# Altium schematic sheet sensors.SchDoc
size A4
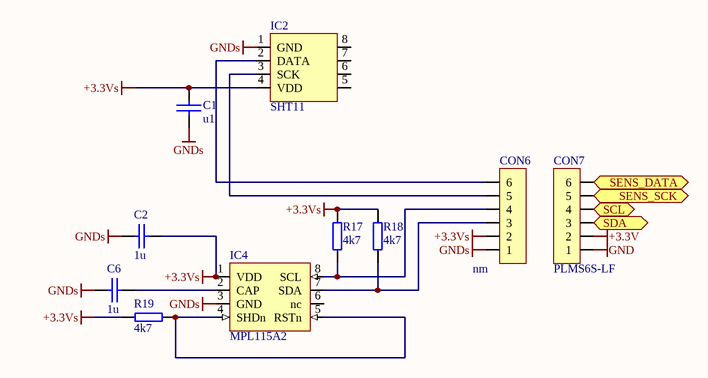
[diagram p0: sensors.SchDoc]

## Parts
C1  u1  [0603]
C2  1u  [0603]
C6  1u  [0603]
CON6  nm  [PLMS6R-2LF]
CON7  PLMS6S-LF  [PLMS6R-2LF]
IC2  SHT11  [SHT11]
IC4  MPL115A2  [LGA8]
R17  4k7  [0603]
R18  4k7  [0603]
R19  4k7  [0603]

## Ports
SCL (in), SDA (bidir), SENS_DATA (bidir), SENS_SCK (in)

## Nets
+3.3V: CON7.2
+3.3Vs: C1.1 C2.2 CON6.2 IC2.4(VDD) IC4.1(VDD) R17.2 R18.2 R19.2
GND: CON7.1
GNDs: C1.2 C2.1 C6.1 CON6.1 IC2.1(GND) IC4.3(GND)
SCL: CON7.4 ; port SCL
SDA: CON7.3 ; port SDA
SENS_DATA: CON7.6 ; port SENS_DATA
SENS_SCK: CON7.5 ; port SENS_SCK
NetC6_2: C6.2 IC4.2(CAP)
NetCON6_3: CON6.3 IC4.7(SDA) R18.1
NetCON6_4: CON6.4 IC4.8(SCL) R17.1
NetCON6_5: CON6.5 IC2.3(SCK)
NetCON6_6: CON6.6 IC2.2(DATA)
NetIC4_4: IC4.4(SHDn) IC4.5(RSTn) R19.1

Not connected (* = marked no-connect by the designer): IC2 5 6 7 8; IC4 6(nc)

## Library data of the parts
C1 C2 C6 = CAP_SMD: Capacitor SMD
CON6 CON7 = CON_6_goldpin_RA_2mm: 2mm RA goldpin
IC2 = SHT11: temp/humidity sensor
IC4 = SENS_MPL115A2: Miniature I2C Digital Barometer
R17-R19 = RES_SMD: SMD Resistor